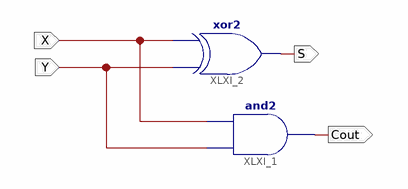
[diagram p0: schematic sheet 1]
// Xilinx ISE schematic HalfAdder.sch (spartan6) as structural Verilog: 2 symbols, 4 ports
module HalfAdder (
  input  X,
  input  Y,
  output S,
  output Cout
);

  and XLXI_1 (Cout, Y, X);
  xor XLXI_2 (S, Y, X);
endmodule
